# Altium project Tunguska.PrjPcb (part 3 of 4)

## Sheet Fan.SchDoc: Fan & Heater Control
size A4; Engineer: A. Küllenberg; Revision: A; SheetNumber: 9; SheetTotal: 10
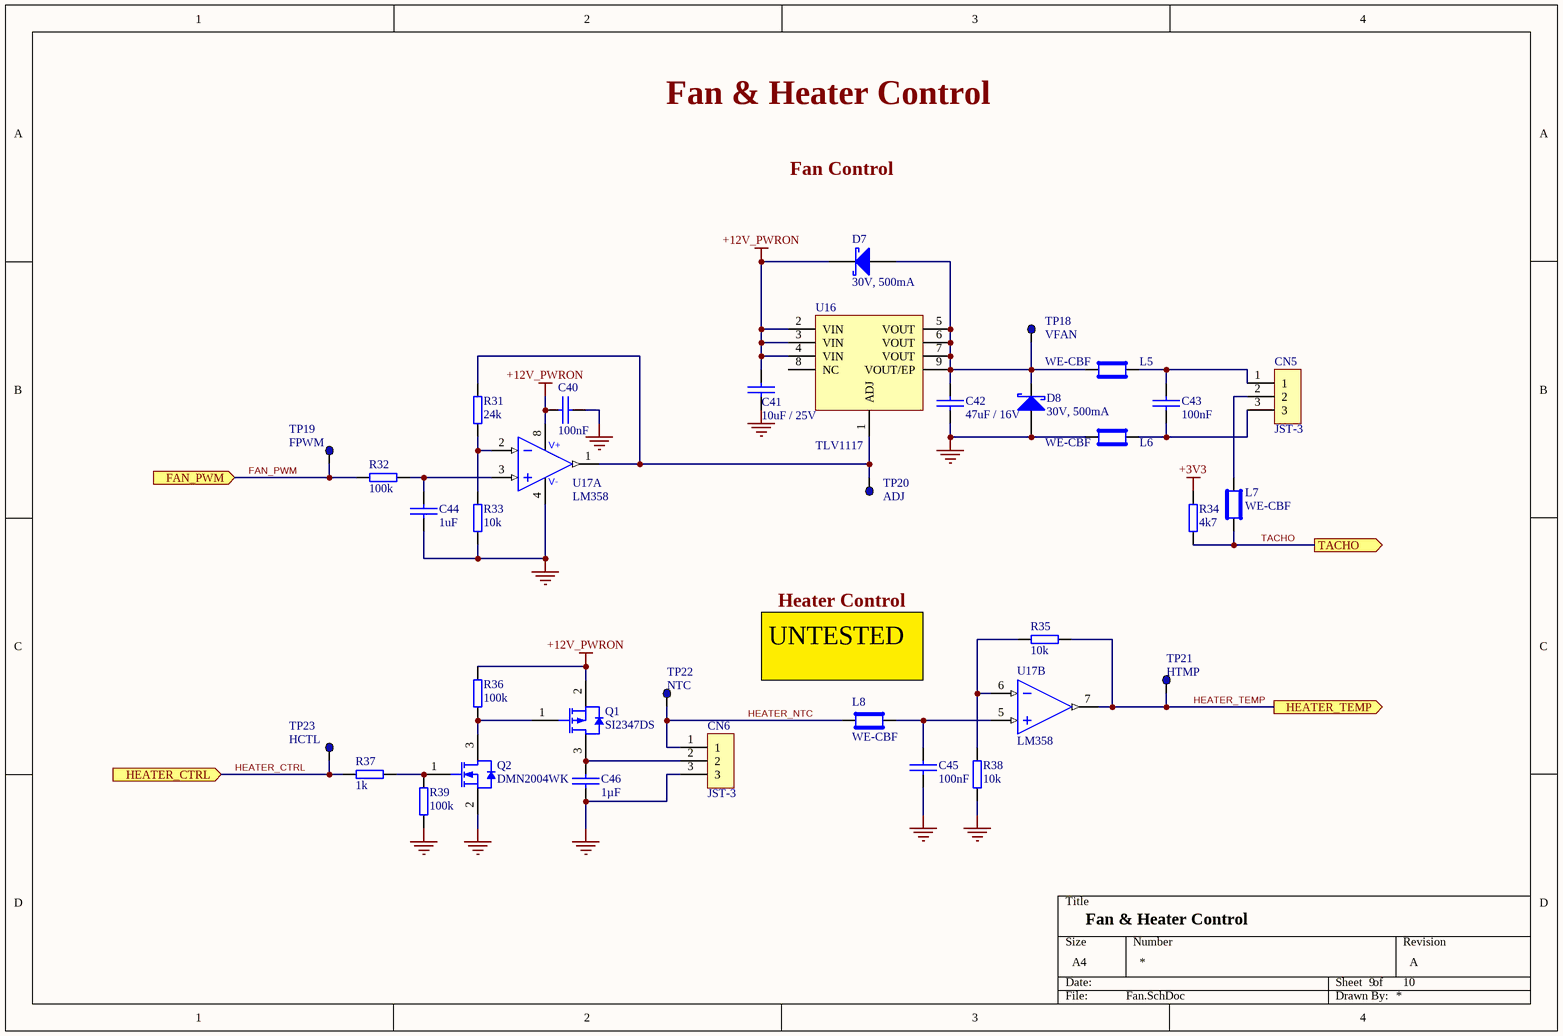
[diagram p4: Fan.SchDoc]

### Parts
C40  100nF  [C0603]
C41  10uF / 25V  [C0603]
C42  47uF / 16V  [C1206]
C43  100nF  [C0603]
C44  1uF  [C0603]
C45  100nF  [C0603]
C46  1µF  [C0805]
CN5  JST-3  [JST-3]
CN6  JST-3  [JST-3]
D7  30V, 500mA  [SOD523_N]
D8  30V, 500mA  [SOD523_N]
L5  WE-CBF  [L0603]
L6  WE-CBF  [L0603]
L7  WE-CBF  [L0603]
L8  WE-CBF  [L0603]
Q1  SI2347DS  [SOT23-3_N]
Q2  DMN2004WK  [SC-70]
R31  24k  [R0603]
R32  100k  [R0603]
R33  10k  [R0603]
R34  4k7  [R0603]
R35  10k  [R0603]
R36  100k  [R0603]
R37  1k  [R0603]
R38  10k  [R0603]
R39  100k  [R0603]
TP18  VFAN  [TP_1mm]  (no BOM)
TP19  FPWM  [TP_1mm]  (no BOM)
TP20  ADJ  [TP_1mm]  (no BOM)
TP21  HTMP  [TP_1mm]  (no BOM)
TP22  NTC  [TP_1mm]  (no BOM)
TP23  HCTL  [TP_1mm]  (no BOM)
U16  TLV1117  [QFN80P400X400X80_HS-9N]
U17  LM358  [DFN 2x2_LM358]  (parts A,B of 2)

### Ports
FAN_PWM (in), HEATER_CTRL (in), HEATER_TEMP (out), TACHO (out)

### Nets
+3V3: R34.2
+12V_PWRON: C40.1 C41.2 D7.2(K) Q1.2(S) R36.2 U16.2(VIN) U16.3(VIN) U16.4(VIN) U17.8(V+)
GND: C40.2 C41.1 C42.1 C44.1 C45.1 C46.1 CN6.3 D8.1(A) L6.1 Q2.2(S) R33.2 R38.1 R39.1 U17.4(V-)
FAN_PWM: R32.1 TP19.1 ; port FAN_PWM
HEATER_CTRL: R37.2 TP23.1 ; port HEATER_CTRL
HEATER_NTC: CN6.1 L8.1 TP22.1
HEATER_TEMP: R35.2 TP21.1 U17.7(OUT) ; port HEATER_TEMP  [project net ADC_IN3]
TACHO: L7.1 R34.1 ; port TACHO
NetC42_2: C42.2 D7.1(A) D8.2(K) L5.1 TP18.1 U16.5(VOUT) U16.6(VOUT) U16.7(VOUT) U16.9(VOUT/EP)
NetC43_1: C43.1 CN5.3 L6.2
NetC43_2: C43.2 CN5.1 L5.2
NetC44_2: C44.2 R32.2 U17.3(IN+)
NetC45_2: C45.2 L8.2 U17.5(IN+)
NetC46_2: C46.2 CN6.2 Q1.3(D)
NetCN5_2: CN5.2 L7.2
NetQ1_1: Q1.1(G) Q2.3(D) R36.1
NetQ2_1: Q2.1(G) R37.1 R39.2
NetR31_1: R31.1 R33.1 U17.2(IN-)
NetR31_2: R31.2 TP20.1 U16.1(ADJ) U17.1(OUT)
NetR35_1: R35.1 R38.2 U17.6(IN-)

Not connected (* = marked no-connect by the designer): U16 8(NC)

### Notes on the sheet
- Fan & Heater Control
- Fan Control
- Heater Control
- (near L8) UNTESTED

### Library data of the parts
C40 C43 C45 = C0603C104K5RACTU: CAP CER 0.1UF 50V X7R 0603; Manufacturer: Kemet; Capacitance: 0.10µF; Tolerance: ±10%; Part Number: C0603C104K5RACTU; Value: 100nF; Supplier 1: Digi-Key; Supplier Part Number 1: 399-5089-1-ND; Manufacturer Part Number: C0603C104K5RACTU; RoHS: RoHS Compliant; Category: Capacitors; Stock 1: 1628757; Pricing 1: 1=0.09, 10=0.037, 50=0.0198, 100=0.0167, 250=0.01372, 500=0.01174, 1000=0.00914 (EUR); Packaging: Cut Tape (CT); Voltage - Rated: 50V; Temperature Coefficient: X7R; Mounting Type: Surface Mount, MLCC; Operating Temperature: -55°C ~ 125°C; Applications: General Purpose; Ratings: -; Package / Case: 0603 (1608 Metric); Size / Dimension: 0.063" L x 0.031" W (1.60mm x 0.80mm); Height - Seated (Max): -; Thickness (Max): 0.034" (0.87mm); Lead Spacing: -; Features: -; Lead Style: -; ComponentLink1URL: http://www.kemet.com/docfinder?Partnumber=C0603C104K5RACTU; ComponentLink1Description: http://www.kemet.com/docfinder?Partnumber=C0603C104K5RACTU
C41 = ZRB18AR61E106ME01L: CAP CER 10UF 25V X5R 0603; Manufacturer: Murata Electronics North America; Capacitance: 10µF; Tolerance: ±20%; Part Number: ZRB18AR61E106ME01L; Value: 10uF / 25V; Supplier 1: Digi-Key; Supplier Part Number 1: 490-10991-1-ND; Manufacturer Part Number: ZRB18AR61E106ME01L; RoHS: RoHS Compliant; Category: Capacitors; Stock 1: 23575; Pricing 1: 1=0.4, 10=0.278, 25=0.2284, 50=0.195, 100=0.1671, 250=0.13924, 500=0.12532, 1000=0.10583 (EUR); Packaging: Cut Tape (CT); Voltage - Rated: 25V; Temperature Coefficient: X5R; Mounting Type: Surface Mount, MLCC; Operating Temperature: -55°C ~ 85°C; Applications: Acoustic Noise Reduction; Ratings: -; Package / Case: 0603 (1608 Metric); Size / Dimension: 0.063" L x 0.031" W (1.60mm x 0.80mm); Height - Seated (Max): -; Thickness (Max): 0.047" (1.20mm); Lead Spacing: -; Features: Interposer Termination; Lead Style: -; ComponentLink1URL: http://search.murata.co.jp/Ceramy/image/img/A01X/G101/ENG/ZRB18AR61E106ME01-01.pdf; ComponentLink1Description: http://search.murata.co.jp/Ceramy/image/img/A01X/G101/ENG/ZRB18AR61E106ME01-01.pdf; Part Status: Active
C42 = C3216X5R1C476M160AB: CAP CER 47UF 16V X5R 1206; Manufacturer: TDK Corporation; Capacitance: 47µF; Tolerance: ±20%; Part Number: C3216X5R1C476M160AB; Value: 47uF / 16V; Supplier 1: Digi-Key; Supplier Part Number 1: 445-6003-1-ND; Manufacturer Part Number: C3216X5R1C476M160AB; RoHS: RoHS Compliant; Category: Capacitors; Stock 1: 181623; Pricing 1: 1=0.92, 10=0.724, 25=0.6636, 50=0.6272, 100=0.5427, 250=0.48244, 500=0.41008, 1000=0.36184 (EUR); Packaging: Cut Tape (CT); Voltage - Rated: 16V; Temperature Coefficient: X5R; Mounting Type: Surface Mount, MLCC; Operating Temperature: -55°C ~ 85°C; Applications: General Purpose; Ratings: -; Package / Case: 1206 (3216 Metric); Size / Dimension: 0.126" L x 0.063" W (3.20mm x 1.60mm); Height - Seated (Max): -; Thickness (Max): 0.071" (1.80mm); Lead Spacing: -; Features: Low ESL; Lead Style: -; ComponentLink1URL: https://product.tdk.com/info/en/catalog/datasheets/mlcc_commercial_general_en.pdf; ComponentLink1Description: https://product.tdk.com/info/en/catalog/datasheets/mlcc_commercial_general_en.pdf; Part Status: Active; Failure Rate: -
C44 = GCM188R71E105KA64D: CAP CER 1UF 25V X7R 0603; Manufacturer: Murata Electronics North America; Capacitance: 1µF; Tolerance: ±10%; Part Number: GCM188R71E105KA64D; Value: 1uF; Supplier 1: Digi-Key; Supplier Part Number 1: 490-10673-1-ND; Manufacturer Part Number: GCM188R71E105KA64D; RoHS: RoHS Compliant; Category: Capacitors; Stock 1: 53908; Pricing 1: 1=0.19, 10=0.13, 50=0.0748, 100=0.0617, 250=0.05196, 500=0.04352, 1000=0.03572 (EUR); Packaging: Cut Tape (CT); Voltage - Rated: 25V; Temperature Coefficient: X7R; Mounting Type: Surface Mount, MLCC; Operating Temperature: -55°C ~ 125°C; Applications: Automotive; Ratings: AEC-Q200; Package / Case: 0603 (1608 Metric); Size / Dimension: 0.063" L x 0.031" W (1.60mm x 0.80mm); Height - Seated (Max): -; Thickness (Max): 0.035" (0.90mm); Lead Spacing: -; Features: -; Lead Style: -; ComponentLink1URL: http://www.murata.com/~/media/webrenewal/support/library/catalog/products/capacitor/mlcc/c03e.ashx; ComponentLink1Description: http://www.murata.com/~/media/webrenewal/support/library/catalog/products/capacitor/mlcc/c03e.ashx
C46 = C0805C105K5RACTU: CAP CER 1UF 50V X7R 0805; Manufacturer: Kemet; Tolerance: ±10%; Part Number: C0805C105K5RACTU; Value: 1µF; Supplier 1: Digi-Key; Supplier Part Number 1: 399-7409-1-ND; Manufacturer Part Number: C0805C105K5RACTU; RoHS: RoHS Compliant; Category: Capacitors; Stock 1: 161342; Pricing 1: 1=0.31, 10=0.254, 50=0.1428, 100=0.1268, 250=0.09508, 500=0.084, 1000=0.07449 (EUR); Packaging: Cut Tape (CT); Capacitance: 1µF; Voltage - Rated: 50V; Temperature Coefficient: X7R; Mounting Type: Surface Mount, MLCC; Operating Temperature: -55°C ~ 125°C; Applications: General Purpose; Ratings: -; Package / Case: 0805 (2012 Metric); Size / Dimension: 0.079" L x 0.049" W (2.00mm x 1.25mm); Height - Seated (Max): -; Thickness (Max): 0.055" (1.40mm); Lead Spacing: -; Features: -; Lead Style: -; ComponentLink1URL: http://www.kemet.com/docfinder?Partnumber=C0805C105K5RACTU; ComponentLink1Description: http://www.kemet.com/docfinder?Partnumber=C0805C105K5RACTU
CN5 CN6 = B3B-XH-A(LF)(SN): CONN HEADER XH TOP 3POS 2.5MM; Manufacturer: JST Sales America Inc.; Number of Positions: 3; Number of Positions Loaded: All; Current Rating: 3A; Voltage Rating: 250V; Pitch - Mating: 0.098" (2.50mm); Shrouding: Shrouded - 4 Wall; Style: Board to Cable/Wire; Contact Length - Post: 0.134" (3.40mm); Material Flammability Rating: UL94 V-0; Mated Stacking Heights: 9.8mm; Part Number: B3B-XH-A(LF)(SN); Value: JST-3; Supplier 1: Digi-Key; Supplier Part Number 1: 455-2248-ND; Manufacturer Part Number: B3B-XH-A(LF)(SN); RoHS: RoHS Compliant; Category: Connectors, Interconnects; Stock 1: 206315; Pricing 1: 1=0.18, 10=0.171, 100=0.1053, 500=0.08712, 1000=0.07623, 5000=0.06534, 10000=0.06352 (EUR); Packaging: Bulk; Connector Type: Header; Contact Type: Male Pin; Number of Rows: 1; Mounting Type: Through Hole; Termination: Press-Fit, Solder; Fastening Type: Detent Lock; Features: -; ComponentLink1URL: http://www.jst-mfg.com/product/pdf/eng/eXH.pdf; ComponentLink1Description: http://www.jst-mfg.com/product/pdf/eng/eXH.pdf; Contact Material: Brass; Operating Temperature: -25°C ~ 85°C; Part Status: Active; Row Spacing - Mating: -; Contact Length - Mating: -; Contact Finish - Mating: Tin; Contact Finish Thickness - Mating: -; Insulation Color: Natural; Overall Contact Length: -; Insulation Height: 0.276" (7.00mm); Contact Shape: Square; Ingress Protection: -; Contact Finish - Post: Tin; Insulation Material: Polyamide (PA66), Nylon 6/6; Contact Finish Thickness - Post: -; Applications: -
D7 D8 = BAS 3005B-02V H6327: DIODE SCHOTTKY 30V 500MA SC79-2; Manufacturer: Infineon Technologies; Current - Reverse Leakage @ Vr: 25µA @ 30V; Voltage - Forward (Vf) (Max) @ If: 620mV @ 500mA; Current - Average Rectified (Io): 500mA (DC); Speed: Fast Recovery =< 500ns, > 200mA (Io); Capacitance @ Vr, F: 10pF @ 5V, 1MHz; Part Number: BAS 3005B-02V H6327; Value: 30V, 500mA; Supplier 1: Digi-Key; Supplier Part Number 1: BAS 3005B-02V H6327CT-ND; Manufacturer Part Number: BAS 3005B-02V H6327; RoHS: RoHS Compliant; Category: Discrete Semiconductor Products; Stock 1: 33141; Pricing 1: 1=0.34, 10=0.26, 100=0.1619, 500=0.11066, 1000=0.08507 (EUR); Packaging: Cut Tape (CT); Mounting Type: Surface Mount; Package / Case: SC-79, SOD-523; Supplier Device Package: PG-SC79-2; ComponentLink1URL: http://www.infineon.com/dgdl/Infineon-BAS3005B-DS-v01_01-en.pdf?fileId=db3a30432d9b3066012db880a14b0bc1; ComponentLink1Description: http://www.infineon.com/dgdl/Infineon-BAS3005B-DS-v01_01-en.pdf?fileId=db3a30432d9b3066012db880a14b0bc1; Diode Type: Schottky; Voltage - DC Reverse (Vr) (Max): 30V; Reverse Recovery Time (trr): -; Operating Temperature - Junction: -55°C ~ 125°C
L5-L8 = 742792651: FERRITE BEAD 600 OHM 0603 1LN; Manufacturer: Wurth Electronics Inc.; Filter Type: Signal Line; Number of Lines: 1; Impedance @ Frequency: 600 Ohm @ 100MHz; Current Rating (Max): 1A; DC Resistance (DCR) (Max): 200 mOhm; Part Number: 742792651; Value: WE-CBF; Supplier 1: Digi-Key; Supplier Part Number 1: 732-1593-1-ND; Manufacturer Part Number: 742792651; RoHS: RoHS Compliant; Category: Filters; Stock 1: 99870; Pricing 1: 1=0.22, 10=0.185, 50=0.1806, 100=0.1667, 1000=0.15164 (EUR); Packaging: Cut Tape (CT); Part Status: Active; Ratings: -; Operating Temperature: -55°C ~ 125°C; Package / Case: 0603 (1608 Metric); Mounting Type: Surface Mount; Height (Max): 0.039" (1.00mm); Size / Dimension: 0.063" L x 0.031" W (1.60mm x 0.80mm); ComponentLink1URL: http://katalog.we-online.de/pbs/datasheet/742792651.pdf; ComponentLink1Description: http://katalog.we-online.de/pbs/datasheet/742792651.pdf
Q1 = SI2347DS-T1-GE3: MOSFET P-CH 30V 5A SOT-23; Manufacturer: Vishay Siliconix; FET Type: P-Channel; Current - Continuous Drain (Id) @ 25°C: 5A (Tc); Rds On (Max) @ Id, Vgs: 42 mOhm @ 3.8A, 10V; Vgs(th) (Max) @ Id: 2.5V @ 250µA; Drive Voltage (Max Rds On,  Min Rds On): 4.5V, 10V; Gate Charge (Qg) (Max) @ Vgs: 22nC @ 10V; Input Capacitance (Ciss) (Max) @ Vds: 705pF @ 15V; Vgs (Max): ±20V; Power Dissipation (Max): 1.7W (Tc); Part Number: SI2347DS-T1-GE3; Value: SI2347DS; Supplier 1: Digi-Key; Supplier Part Number 1: SI2347DS-T1-GE3CT-ND; Manufacturer Part Number: SI2347DS-T1-GE3; RoHS: RoHS Compliant; Category: Discrete Semiconductor Products; Stock 1: 19854; Pricing 1: 1=0.41, 10=0.309, 25=0.2784, 100=0.1922, 250=0.16184, 500=0.13148, 1000=0.10114 (EUR); Packaging: Cut Tape (CT); FET Feature: -; Drain to Source Voltage (Vdss): 30V; Mounting Type: Surface Mount; Package / Case: TO-236-3, SC-59, SOT-23-3; Supplier Device Package: SOT-23-3; ComponentLink1URL: http://www.vishay.com/docs/62827/si2347ds.pdf; ComponentLink1Description: http://www.vishay.com/docs/62827/si2347ds.pdf; Operating Temperature: -55°C ~ 150°C (TJ); Part Status: Active; Technology: MOSFET (Metal Oxide)
Q2 = DMN2004WK-7: MOSFET N-CH 20V 540MA SC70-3; Manufacturer: Diodes Incorporated; FET Type: N-Channel; Current - Continuous Drain (Id) @ 25°C: 540mA (Ta); Rds On (Max) @ Id, Vgs: 550 mOhm @ 540mA, 4.5V; Vgs(th) (Max) @ Id: 1V @ 250µA; Drive Voltage (Max Rds On,  Min Rds On): 1.8V, 4.5V; Input Capacitance (Ciss) (Max) @ Vds: 150pF @ 16V; Vgs (Max): ±8V; Power Dissipation (Max): 200mW (Ta); Part Number: DMN2004WK-7; Value: DMN2004WK; Supplier 1: Digi-Key; Supplier Part Number 1: DMN2004WKDICT-ND; Manufacturer Part Number: DMN2004WK-7; RoHS: RoHS Compliant; Category: Discrete Semiconductor Products; Stock 1: 14846; Pricing 1: 1=0.43, 10=0.324, 100=0.2013, 500=0.13776, 1000=0.10596 (EUR); Packaging: Cut Tape (CT); FET Feature: -; Drain to Source Voltage (Vdss): 20V; Mounting Type: Surface Mount; Package / Case: SC-70, SOT-323; Supplier Device Package: SOT-323; ComponentLink1URL: https://www.diodes.com/assets/Datasheets/ds30934.pdf; ComponentLink1Description: https://www.diodes.com/assets/Datasheets/ds30934.pdf; Operating Temperature: -55°C ~ 150°C (TJ); Part Status: Active; Technology: MOSFET (Metal Oxide); Gate Charge (Qg) (Max) @ Vgs: -
R31 = RC0603FR-0724KL: RES SMD 24K OHM 1% 1/10W 0603; Manufacturer: Yageo; Power (Watts): 0.1W, 1/10W; Temperature Coefficient: ±100ppm/°C; Part Number: RC0603FR-0724KL; Value: 24k; Manufacturer Part Number: RC0603FR-0724KL; RoHS: RoHS Compliant; Category: Resistors; Stock 1: 315278; Pricing 1: 1=0.09, 10=0.012, 25=0.0088, 50=0.0066, 100=0.0049, 250=0.00372, 500=0.00298, 1000=0.0022 (EUR); Packaging: Cut Tape (CT); Resistance (Ohms): 24k; Tolerance: ±1%; Composition: Thick Film; Features: Moisture Resistant; Operating Temperature: -55°C ~ 155°C; Package / Case: 0603 (1608 Metric); Supplier Device Package: 0603; Size / Dimension: 0.063" L x 0.031" W (1.60mm x 0.80mm); ComponentLink1URL: http://www.yageo.com/documents/recent/PYu-RC_Group_51_RoHS_L_6.pdf; ComponentLink1Description: http://www.yageo.com/documents/recent/PYu-RC_Group_51_RoHS_L_6.pdf; Supplier 1: Digi-Key; Supplier Part Number 1: 311-24.0KHRCT-ND; Height - Seated (Max): 0.022" (0.55mm); Part Status: Active; Failure Rate: -
R32 R36 R39 = RC0603FR-07100KL: RES SMD 100K OHM 1% 1/10W 0603; Manufacturer: Yageo; Power (Watts): 0.1W, 1/10W; Temperature Coefficient: ±100ppm/°C; Part Number: RC0603FR-07100KL; Value: 100k; Manufacturer Part Number: RC0603FR-07100KL; RoHS: RoHS Compliant; Category: Resistors; Stock 1: 6595647; Pricing 1: 1=0.09, 10=0.012, 25=0.0088, 50=0.007, 100=0.0051, 250=0.00388, 500=0.0031, 1000=0.00229 (EUR); Packaging: Cut Tape (CT); Resistance (Ohms): 100k; Tolerance: ±1%; Composition: Thick Film; Features: Moisture Resistant; Operating Temperature: -55°C ~ 155°C; Package / Case: 0603 (1608 Metric); Supplier Device Package: 0603; Size / Dimension: 0.063" L x 0.031" W (1.60mm x 0.80mm); ComponentLink1URL: http://www.yageo.com/documents/recent/PYu-RC_Group_51_RoHS_L_7.pdf; ComponentLink1Description: http://www.yageo.com/documents/recent/PYu-RC_Group_51_RoHS_L_7.pdf; Supplier 1: Digi-Key; Supplier Part Number 1: 311-100KHRCT-ND; Height - Seated (Max): 0.022" (0.55mm); Part Status: Active; Failure Rate: -
R33 R35 R38 = RC0603FR-0710KL: RES SMD 10K OHM 1% 1/10W 0603; Manufacturer: Yageo; Power (Watts): 0.1W, 1/10W; Temperature Coefficient: ±100ppm/°C; Part Number: RC0603FR-0710KL; Value: 10k; Manufacturer Part Number: RC0603FR-0710KL; RoHS: RoHS Compliant; Category: Resistors; Stock 1: 14298796; Pricing 1: 1=0.09, 10=0.012, 25=0.0088, 50=0.007, 100=0.0051, 250=0.00388, 500=0.0031, 1000=0.00229 (EUR); Packaging: Cut Tape (CT); Resistance (Ohms): 10k; Tolerance: ±1%; Composition: Thick Film; Features: Moisture Resistant; Operating Temperature: -55°C ~ 155°C; Package / Case: 0603 (1608 Metric); Supplier Device Package: 0603; Size / Dimension: 0.063" L x 0.031" W (1.60mm x 0.80mm); ComponentLink1URL: http://www.yageo.com/documents/recent/PYu-RC_Group_51_RoHS_L_7.pdf; ComponentLink1Description: http://www.yageo.com/documents/recent/PYu-RC_Group_51_RoHS_L_7.pdf; Supplier 1: Digi-Key; Supplier Part Number 1: 311-10.0KHRCT-ND; Height - Seated (Max): 0.022" (0.55mm); Part Status: Active; Failure Rate: -
R34 = CRCW06034K70FKEA: RES SMD 4.7K OHM 1% 1/10W 0603; Manufacturer: Vishay Dale; Power (Watts): 0.1W, 1/10W; Temperature Coefficient: ±100ppm/°C; Part Number: CRCW06034K70FKEA; Value: 4k7; Manufacturer Part Number: CRCW06034K70FKEA; RoHS: RoHS Compliant; Category: Resistors; Stock 1: 324271; Pricing 1: 1=0.09, 10=0.027, 25=0.0196, 50=0.015, 100=0.011, 250=0.0084, 500=0.00674, 1000=0.00496, 2500=0.00431 (EUR); Packaging: Cut Tape (CT); Resistance (Ohms): 4.7k; Tolerance: ±1%; Composition: Thick Film; Features: Automotive AEC-Q200; Operating Temperature: -55°C ~ 155°C; Package / Case: 0603 (1608 Metric); Supplier Device Package: 0603; Size / Dimension: 0.061" L x 0.033" W (1.55mm x 0.85mm); Height: 0.020" (0.50mm); Number of Terminations: 2; ComponentLink1URL: http://www.vishay.com/docs/20035/dcrcwe3.pdf; ComponentLink1Description: http://www.vishay.com/docs/20035/dcrcwe3.pdf; Supplier 1: Digi-Key; Supplier Part Number 1: 541-4.70KHCT-ND
R37 = CRCW06031K00FKEA: RES SMD 1K OHM 1% 1/10W 0603; Manufacturer: Vishay Dale; Power (Watts): 0.1W, 1/10W; Temperature Coefficient: ±100ppm/°C; Part Number: CRCW06031K00FKEA; Value: 1k; Manufacturer Part Number: CRCW06031K00FKEA; RoHS: RoHS Compliant; Category: Resistors; Stock 1: 862886; Pricing 1: 1=0.09, 10=0.027, 25=0.0196, 50=0.015, 100=0.011, 250=0.0084, 500=0.00674, 1000=0.00496, 2500=0.00431 (EUR); Packaging: Cut Tape (CT); Resistance (Ohms): 1k; Tolerance: ±1%; Composition: Thick Film; Features: Automotive AEC-Q200; Operating Temperature: -55°C ~ 155°C; Package / Case: 0603 (1608 Metric); Supplier Device Package: 0603; Size / Dimension: 0.061" L x 0.033" W (1.55mm x 0.85mm); Height: 0.020" (0.50mm); Number of Terminations: 2; ComponentLink1URL: http://www.vishay.com/docs/20035/dcrcwe3.pdf; ComponentLink1Description: http://www.vishay.com/docs/20035/dcrcwe3.pdf; Supplier 1: Digi-Key; Supplier Part Number 1: 541-1.00KHCT-ND
TP18-TP23 = TP: Value: TP; Part Number: TP
U16 = TLV1117IDRJR: IC REG LDO ADJ 0.8A 8SON; Manufacturer: Texas Instruments; Regulator Topology: Positive Adjustable; Voltage - Output: Adjustable; Current - Output: 800mA; Voltage - Dropout (Typical): 1.2V @ 800mA; Voltage - Input: 2.7 V ~ 15 V; Part Number: TLV1117IDRJR; Value: TLV1117; Supplier 1: Digi-Key; Supplier Part Number 1: 296-19517-1-ND; Manufacturer Part Number: TLV1117IDRJR; RoHS: RoHS Compliant; Category: Integrated Circuits (ICs); Stock 1: 3485; Pricing 1: 1=0.62, 10=0.549, 100=0.4209, 500=0.3328 (EUR); Packaging: Cut Tape (CT); Current - Limit (Min): 800mA; Operating Temperature: -40°C ~ 125°C; Mounting Type: Surface Mount; Package / Case: 8-WDFN Exposed Pad; Supplier Device Package: 8-SON (4x4); ComponentLink1URL: http://www.ti.com/lit/ds/symlink/tlv1117.pdf; ComponentLink1Description: http://www.ti.com/lit/ds/symlink/tlv1117.pdf; Part Status: Active
U17 = LM358QT: IC OPAMP GP 1.1MHZ 8DFN; Manufacturer: STMicroelectronics; Amplifier Type: General Purpose; Number of Circuits: 2; Slew Rate: 0.6 V/µs; Current - Supply: 700µA; Current - Output / Channel: 60mA; Voltage - Supply, Single/Dual (±): 3 V ~ 30 V, ±1.5 V ~ 15 V; Part Number: LM358QT; Value: LM358; Supplier 1: Digi-Key; Supplier Part Number 1: 497-12007-1-ND; Manufacturer Part Number: LM358QT; RoHS: RoHS Compliant; Category: Integrated Circuits (ICs); Stock 1: 1511; Pricing 1: 1=0.43, 10=0.324, 100=0.2013, 500=0.13776, 1000=0.10596 (EUR); Packaging: Cut Tape (CT); Output Type: -; -3db Bandwidth: -; Operating Temperature: 0°C ~ 70°C; Mounting Type: Surface Mount; Package / Case: 8-UFDFN Exposed Pad; Supplier Device Package: 8-DFN (2x2); ComponentLink1URL: http://www.st.com/content/ccc/resource/technical/document/datasheet/61/46/87/01/98/ed/44/c5/CD00000464.pdf/files/CD00000464.pdf/jcr:content/translations/en.CD00000464.pdf; ComponentLink1Description: http://www.st.com/content/ccc/resource/technical/document/datasheet/61/46/87/01/98/ed/44/c5/CD00000464.pdf/files/CD00000464.pdf/jcr:content/translations/en.CD00000464.pdf; Part Status: Active

## Sheet PowerPath.SchDoc: Power Path
size A4; DrawnBy: A. Küllenberg; Revision: A; SheetNumber: 4; SheetTotal: 10
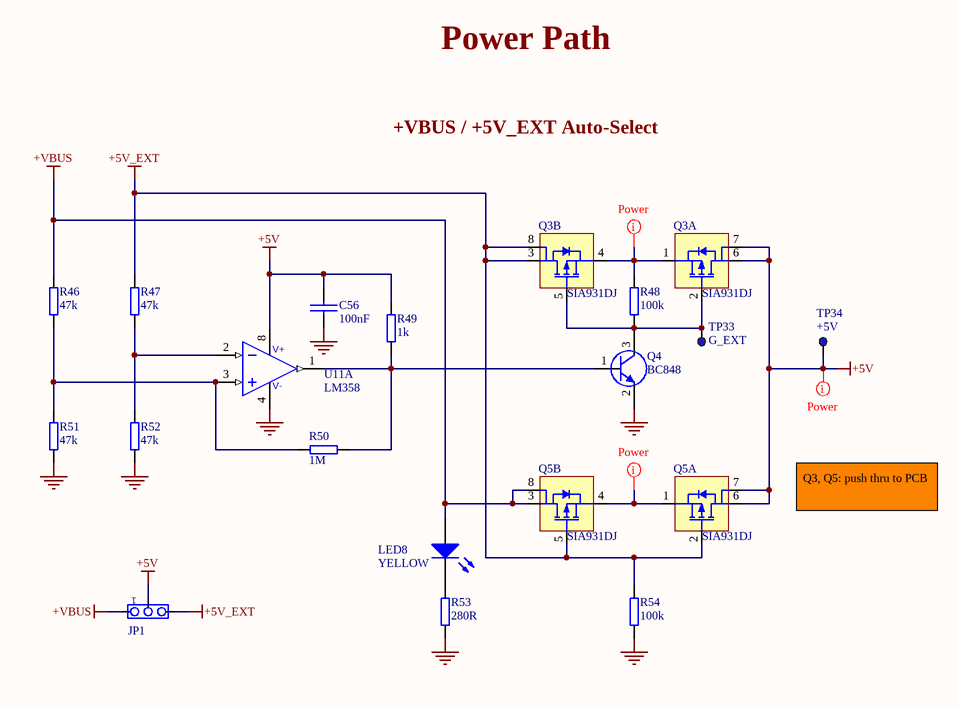
[diagram p5: PowerPath.SchDoc]

### Parts
C56  100nF  [C0603]
JP1  JP  [HDR1x3]  (value not drawn)
LED8  YELLOW  [LED_0603_YELLOW]
Q3  SIA931DJ  [PowerPAK SC-70-6L Dual]  (parts A,B of 2)
Q4  BC848  [SC-70]
Q5  SIA931DJ  [PowerPAK SC-70-6L Dual]  (parts A,B of 2)
R46  47k  [R0603]
R47  47k  [R0603]
R48  100k  [R0603]
R49  1k  [R0603]
R50  1M  [R0603]
R51  47k  [R0603]
R52  47k  [R0603]
R53  280R  [R0603]
R54  100k  [R0603]
TP33  G_EXT  [TP_1mm]  (no BOM)
TP34  +5V  [TP_1mm]  (no BOM)
U11  LM358  [DFN 2x2_LM358]  (part A of 2)

### Nets
+5V: C56.2 JP1.2 Q3.6(D1) Q3.7(D1) Q5.6(D1) Q5.7(D1) R49.2 TP34.1 U11.8(V+)
+5V_EXT: JP1.3 Q3.3(D2) Q3.8(D2) Q5.2(G1) Q5.5(G2) R47.2 R54.2
+VBUS: JP1.1 LED8.1(A) Q5.3(D2) Q5.8(D2) R46.2
GND: C56.1 Q4.2 R51.1 R52.1 R53.1 R54.1 U11.4(V-)
NetLED8_2: LED8.2(K) R53.2
NetQ3_1: Q3.1(S1) Q3.4(S2) R48.2
NetQ3_2: Q3.2(G1) Q3.5(G2) Q4.3 R48.1 TP33.1
NetQ4_1: Q4.1 R49.1 R50.1 U11.1(OUT)
NetQ5_1: Q5.1(S1) Q5.4(S2)
NetR46_1: R46.1 R50.2 R51.2 U11.3(IN+)
NetR47_1: R47.1 R52.2 U11.2(IN-)

### Layout directives
net class Power: +5V, NetQ3_1, NetQ5_1

### Notes on the sheet
- Power Path
- +VBUS / +5V_EXT Auto-Select
- Q3, Q5: push thru to PCB

### Library data of the parts
C56 = C0603C104K5RACTU: as C40 on sheet Fan; Part Number: C0603C104K5RACTU; Value: 100nF; Supplier 1: Digi-Key; Supplier Part Number 1: 399-5089-1-ND; Manufacturer Part Number: C0603C104K5RACTU; RoHS: RoHS Compliant; Category: Capacitors; Stock 1: 1628757; Pricing 1: 1=0.09, 10=0.037, 50=0.0198, 100=0.0167, 250=0.01372, 500=0.01174, 1000=0.00914 (EUR); Packaging: Cut Tape (CT); Voltage - Rated: 50V; Temperature Coefficient: X7R; Mounting Type: Surface Mount, MLCC; Operating Temperature: -55°C ~ 125°C; Applications: General Purpose; Ratings: -; Package / Case: 0603 (1608 Metric); Size / Dimension: 0.063" L x 0.031" W (1.60mm x 0.80mm); Height - Seated (Max): -; Thickness (Max): 0.034" (0.87mm); Lead Spacing: -; Features: -; Lead Style: -; ComponentLink1URL: http://www.kemet.com/docfinder?Partnumber=C0603C104K5RACTU; ComponentLink1Description: http://www.kemet.com/docfinder?Partnumber=C0603C104K5RACTU
JP1 = 61300311121: CONN HEADER 3 POS 2.54; Manufacturer: Wurth Electronics Inc.; Pitch - Mating: 0.100" (2.54mm); Style: Board to Board or Cable; Shrouding: Unshrouded; Number of Positions: 3; Number of Positions Loaded: All; Contact Length - Mating: 0.236" (6.00mm); Contact Length - Post: 0.118" (3.00mm); Overall Contact Length: 0.454" (11.54mm); Material Flammability Rating: UL94 V-0; Current Rating: 3A; Voltage Rating: 250V; Part Number: 61300311121; Value: JP; Supplier 1: Digi-Key; Supplier Part Number 1: 732-5316-ND; Manufacturer Part Number: 61300311121; RoHS: RoHS Compliant; Category: Connectors, Interconnects; Stock 1: 31558; Pricing 1: 1=0.21, 10=0.191, 25=0.1628, 50=0.1424, 100=0.1323, 1000=0.09157 (EUR); Packaging: Bulk; Part Status: Active; Connector Type: Header; Contact Type: Male Pin; Number of Rows: 1; Row Spacing - Mating: -; Mounting Type: Through Hole; Termination: Solder; Fastening Type: -; Insulation Height: 0.100" (2.54mm); Contact Shape: Square; Contact Finish - Mating: Gold; Contact Finish Thickness - Mating: -; Contact Finish - Post: -; Contact Material: Copper Alloy; Insulation Material: Polybutylene Terephthalate (PBT); Features: -; Operating Temperature: -40°C ~ 125°C; Ingress Protection: -; Insulation Color: Black; Mated Stacking Heights: -; Contact Finish Thickness - Post: -; Applications: -; ComponentLink1URL: http://katalog.we-online.de/em/datasheet/6130xx11121.pdf; ComponentLink1Description: http://katalog.we-online.de/em/datasheet/6130xx11121.pdf
LED8 = LTST-C190KSKT: LED YELLOW CLEAR 0603 SMD; Manufacturer: Lite-On Inc.; Voltage - Forward (Vf) (Typ): 2.1V; Viewing Angle: 130°; Wavelength - Dominant: 591nm; Wavelength - Peak: 588nm; Millicandela Rating: 104mcd; Current - Test: 20mA; Lens Color: Colorless; Lens Style/Size: Rectangle with Flat Top, 1.10mm x 0.80mm; Part Number: LTST-C190KSKT; Value: YELLOW; Supplier 1: Digi-Key; Supplier Part Number 1: 160-1437-1-ND; Manufacturer Part Number: LTST-C190KSKT; RoHS: RoHS Compliant; Category: Optoelectronics; Stock 1: 229638; Pricing 1: 1=0.27, 10=0.199, 25=0.1468, 100=0.1049, 250=0.07132, 500=0.06292, 1000=0.0493 (EUR); Packaging: Cut Tape (CT); Mounting Type: Surface Mount; Package / Case: 0603 (1608 Metric); ComponentLink1URL: http://optoelectronics.liteon.com/upload/download/DS-22-99-0189/S_110_LTST-C190KSKT.pdf; ComponentLink1Description: http://optoelectronics.liteon.com/upload/download/DS-22-99-0189/S_110_LTST-C190KSKT.pdf; Color: Yellow; Lens Transparency: Clear; Size / Dimension: 1.60mm L x 0.80mm W; Height (Max): 0.80mm; Features: -; Part Status: Active
Q3 Q5 = SIA931DJ-T1-GE3: MOSFET 2P-CH 30V 4.5A SC70-6L; Manufacturer: Vishay Siliconix; FET Type: 2 P-Channel (Dual); FET Feature: Logic Level Gate; Rds On (Max) @ Id, Vgs: 65 mOhm @ 3A, 10V; Vgs(th) (Max) @ Id: 2.2V @ 250µA; Power - Max: 7.8W; Gate Charge (Qg) (Max) @ Vgs: 13nC @ 10V; Input Capacitance (Ciss) (Max) @ Vds: 445pF @ 15V; Part Number: SIA931DJ-T1-GE3; Value: SIA931DJ; Supplier 1: Digi-Key; Supplier Part Number 1: SIA931DJ-T1-GE3CT-ND; Manufacturer Part Number: SIA931DJ-T1-GE3; RoHS: RoHS Compliant; Category: Discrete Semiconductor Products; Stock 1: 5457; Pricing 1: 1=0.51, 10=0.44, 25=0.4108, 100=0.3287, 250=0.30524, 500=0.2583, 1000=0.19959 (EUR); Packaging: Cut Tape (CT); Drain to Source Voltage (Vdss): 30V; Current - Continuous Drain (Id) @ 25°C: 4.5A; Mounting Type: Surface Mount; Package / Case: PowerPAK® SC-70-6 Dual; Supplier Device Package: PowerPAK® SC-70-6 Dual; ComponentLink1URL: http://www.vishay.com/docs/62859/sia931dj.pdf; ComponentLink1Description: http://www.vishay.com/docs/62859/sia931dj.pdf; Operating Temperature: -55°C ~ 150°C (TJ); Part Status: Active
Q4 = BC848W,115: TRANS NPN 30V 0.1A SOT323; Manufacturer: Nexperia USA Inc.; Current - Collector (Ic) (Max): 100mA; Vce Saturation (Max) @ Ib, Ic: 600mV @ 5mA, 100mA; Current - Collector Cutoff (Max): 15nA (ICBO); DC Current Gain (hFE) (Min) @ Ic, Vce: 110 @ 2mA, 5V; Power - Max: 200mW; Frequency - Transition: 100MHz; Part Number: BC848W,115; Value: BC848; Supplier 1: Digi-Key; Supplier Part Number 1: 1727-6193-1-ND; Manufacturer Part Number: BC848W,115; RoHS: RoHS Compliant; Category: Discrete Semiconductor Products; Stock 1: 2939; Pricing 1: 1=0.13, 10=0.12, 100=0.0651, 500=0.04004, 1000=0.02731 (EUR); Packaging: Cut Tape (CT); Part Status: Active; Transistor Type: NPN; Voltage - Collector Emitter Breakdown (Max): 30V; Operating Temperature: 150°C (TJ); Mounting Type: Surface Mount; Package / Case: SC-70, SOT-323; Supplier Device Package: SOT-323-3; ComponentLink1URL: http://assets.nexperia.com/documents/data-sheet/BC848_SER.pdf; ComponentLink1Description: http://assets.nexperia.com/documents/data-sheet/BC848_SER.pdf
R46 R47 R51 R52 = RC0603FR-0747KL: RES SMD 47K OHM 1% 1/10W 0603; Manufacturer: Yageo; Power (Watts): 0.1W, 1/10W; Temperature Coefficient: ±100ppm/°C; Part Number: RC0603FR-0747KL; Value: 47k; Manufacturer Part Number: RC0603FR-0747KL; RoHS: RoHS Compliant; Category: Resistors; Stock 1: 2291730; Pricing 1: 1=0.09, 10=0.012, 25=0.0088, 50=0.007, 100=0.0051, 250=0.00388, 500=0.0031, 1000=0.00229 (EUR); Packaging: Cut Tape (CT); Resistance (Ohms): 47k; Tolerance: ±1%; Composition: Thick Film; Features: Moisture Resistant; Operating Temperature: -55°C ~ 155°C; Package / Case: 0603 (1608 Metric); Supplier Device Package: 0603; Size / Dimension: 0.063" L x 0.031" W (1.60mm x 0.80mm); ComponentLink1URL: http://www.yageo.com/documents/recent/PYu-RC_Group_51_RoHS_L_7.pdf; ComponentLink1Description: http://www.yageo.com/documents/recent/PYu-RC_Group_51_RoHS_L_7.pdf; Supplier 1: Digi-Key; Supplier Part Number 1: 311-47.0KHRCT-ND; Height - Seated (Max): 0.022" (0.55mm); Part Status: Active; Failure Rate: -
R48 R54 = RC0603FR-07100KL: as R32 on sheet Fan; Part Number: RC0603FR-07100KL; Value: 100k; Manufacturer Part Number: RC0603FR-07100KL; RoHS: RoHS Compliant; Category: Resistors; Stock 1: 6595647; Pricing 1: 1=0.09, 10=0.012, 25=0.0088, 50=0.007, 100=0.0051, 250=0.00388, 500=0.0031, 1000=0.00229 (EUR); Packaging: Cut Tape (CT); Resistance (Ohms): 100k; Tolerance: ±1%; Composition: Thick Film; Features: Moisture Resistant; Operating Temperature: -55°C ~ 155°C; Package / Case: 0603 (1608 Metric); Supplier Device Package: 0603; Size / Dimension: 0.063" L x 0.031" W (1.60mm x 0.80mm); ComponentLink1URL: http://www.yageo.com/documents/recent/PYu-RC_Group_51_RoHS_L_7.pdf; ComponentLink1Description: http://www.yageo.com/documents/recent/PYu-RC_Group_51_RoHS_L_7.pdf; Supplier 1: Digi-Key; Supplier Part Number 1: 311-100KHRCT-ND; Height - Seated (Max): 0.022" (0.55mm); Part Status: Active; Failure Rate: -
R49 = CRCW06031K00FKEA: as R37 on sheet Fan; Part Number: CRCW06031K00FKEA; Value: 1k; Manufacturer Part Number: CRCW06031K00FKEA; RoHS: RoHS Compliant; Category: Resistors; Stock 1: 862886; Pricing 1: 1=0.09, 10=0.027, 25=0.0196, 50=0.015, 100=0.011, 250=0.0084, 500=0.00674, 1000=0.00496, 2500=0.00431 (EUR); Packaging: Cut Tape (CT); Resistance (Ohms): 1k; Tolerance: ±1%; Composition: Thick Film; Features: Automotive AEC-Q200; Operating Temperature: -55°C ~ 155°C; Package / Case: 0603 (1608 Metric); Supplier Device Package: 0603; Size / Dimension: 0.061" L x 0.033" W (1.55mm x 0.85mm); Height: 0.020" (0.50mm); Number of Terminations: 2; ComponentLink1URL: http://www.vishay.com/docs/20035/dcrcwe3.pdf; ComponentLink1Description: http://www.vishay.com/docs/20035/dcrcwe3.pdf; Supplier 1: Digi-Key; Supplier Part Number 1: 541-1.00KHCT-ND
R50 = RC0603FR-071ML: RES SMD 1M OHM 1% 1/10W 0603; Manufacturer: Yageo; Power (Watts): 0.1W, 1/10W; Temperature Coefficient: ±100ppm/°C; Part Number: RC0603FR-071ML; Value: 1M; Manufacturer Part Number: RC0603FR-071ML; RoHS: RoHS Compliant; Category: Resistors; Stock 1: 3055845; Pricing 1: 1=0.09, 10=0.012, 25=0.0088, 50=0.0066, 100=0.0049, 250=0.00372, 500=0.00298, 1000=0.0022 (EUR); Packaging: Cut Tape (CT); Resistance (Ohms): 1M; Tolerance: ±1%; Composition: Thick Film; Features: Moisture Resistant; Operating Temperature: -55°C ~ 155°C; Package / Case: 0603 (1608 Metric); Supplier Device Package: 0603; Size / Dimension: 0.063" L x 0.031" W (1.60mm x 0.80mm); ComponentLink1URL: http://www.yageo.com/documents/recent/PYu-RC_Group_51_RoHS_L_7.pdf; ComponentLink1Description: http://www.yageo.com/documents/recent/PYu-RC_Group_51_RoHS_L_7.pdf; Supplier 1: Digi-Key; Supplier Part Number 1: 311-1.00MHRCT-ND; Height - Seated (Max): 0.022" (0.55mm); Part Status: Active; Failure Rate: -
R53 = RC0603FR-07280RL: RES SMD 280 OHM 1% 1/10W 0603; Manufacturer: Yageo; Resistance (Ohms): 280; Power (Watts): 0.1W, 1/10W; Temperature Coefficient: ±100ppm/°C; Part Number: RC0603FR-07280RL; Value: 280R; Manufacturer Part Number: RC0603FR-07280RL; RoHS: RoHS Compliant; Category: Resistors; Stock 1: 47; Pricing 1: 1=0.09, 10=0.012, 25=0.0088, 50=0.0066, 100=0.0049, 250=0.00372, 500=0.00298, 1000=0.0022 (EUR); Packaging: Cut Tape (CT); Tolerance: ±1%; Composition: Thick Film; Features: Moisture Resistant; Operating Temperature: -55°C ~ 155°C; Package / Case: 0603 (1608 Metric); Supplier Device Package: 0603; Size / Dimension: 0.063" L x 0.031" W (1.60mm x 0.80mm); ComponentLink1URL: http://www.yageo.com/documents/recent/PYu-RC_Group_51_RoHS_L_6.pdf; ComponentLink1Description: http://www.yageo.com/documents/recent/PYu-RC_Group_51_RoHS_L_6.pdf; Supplier 1: Digi-Key; Supplier Part Number 1: 311-280HRCT-ND; Height - Seated (Max): 0.022" (0.55mm); Part Status: Active; Failure Rate: -
TP33 TP34 = TP: Value: TP; Part Number: TP
U11 = LM358QT: as U17 on sheet Fan; Part Number: LM358QT; Value: LM358; Supplier 1: Digi-Key; Supplier Part Number 1: 497-12007-1-ND; Manufacturer Part Number: LM358QT; RoHS: RoHS Compliant; Category: Integrated Circuits (ICs); Stock 1: 1511; Pricing 1: 1=0.43, 10=0.324, 100=0.2013, 500=0.13776, 1000=0.10596 (EUR); Packaging: Cut Tape (CT); Output Type: -; -3db Bandwidth: -; Operating Temperature: 0°C ~ 70°C; Mounting Type: Surface Mount; Package / Case: 8-UFDFN Exposed Pad; Supplier Device Package: 8-DFN (2x2); ComponentLink1URL: http://www.st.com/content/ccc/resource/technical/document/datasheet/61/46/87/01/98/ed/44/c5/CD00000464.pdf/files/CD00000464.pdf/jcr:content/translations/en.CD00000464.pdf; ComponentLink1Description: http://www.st.com/content/ccc/resource/technical/document/datasheet/61/46/87/01/98/ed/44/c5/CD00000464.pdf/files/CD00000464.pdf/jcr:content/translations/en.CD00000464.pdf; Part Status: Active

## Sheet WiFi.SchDoc: WiFi Module
size A4; DrawnBy: A. Küllenberg; Revision: A; SheetNumber: 8; SheetTotal: 10
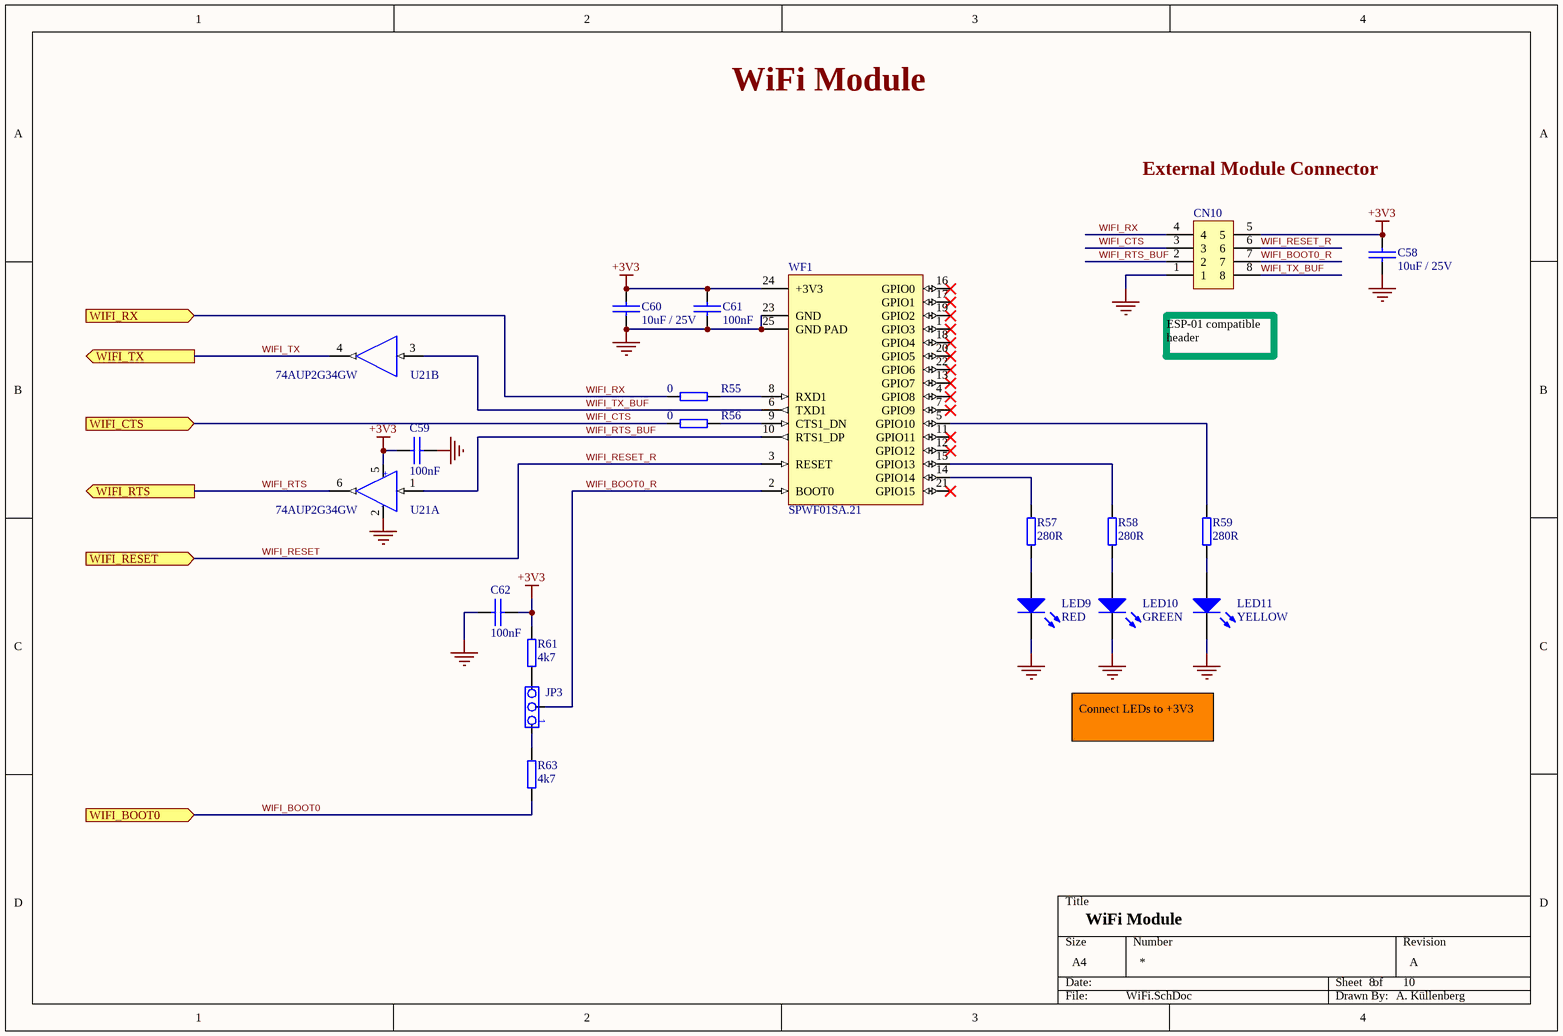
[diagram p6: WiFi.SchDoc]

### Parts
C58  10uF / 25V  [C0603]
C59  100nF  [C0603]
C60  10uF / 25V  [C0603]
C61  100nF  [C0603]
C62  100nF  [C0603]
CN10  HDR 2x4  [PPPC042LFBN-RC]  (value not drawn)
JP3  JP  [HDR1x3]  (value not drawn)
LED9  RED  [LED_0603_RED]
LED10  GREEN  [LED_0603_GREEN]
LED11  YELLOW  [LED_0603_YELLOW]
R55  0  [R0603]
R56  0  [R0603]
R57  280R  [R0603]
R58  280R  [R0603]
R59  280R  [R0603]
R61  4k7  [R0603]
R63  4k7  [R0603]
U21  74AUP2G34GW  [SOT363]  (parts A,B of 2)
WF1  SPWF01SA.21  [SPWF01SA]

### Ports
WIFI_BOOT0 (in), WIFI_CTS (in), WIFI_RESET (in), WIFI_RTS (out), WIFI_RX (in), WIFI_TX (out)

### Nets
+3V3: C58.2 C59.2 C60.2 C61.2 C62.1 CN10.5 R61.2 U21.5 WF1.24(+3V3)
GND: C58.1 C59.1 C60.1 C61.1 C62.2 CN10.1 LED9.2(K) LED10.2(K) LED11.2(K) U21.2 WF1.23(GND) WF1.25(GND_PAD)
WIFI_BOOT0: R63.1 ; port WIFI_BOOT0  [project net PC12]
WIFI_BOOT0_R: CN10.7 JP3.2 WF1.2(BOOT0)
WIFI_CTS: CN10.3 R56.1 ; port WIFI_CTS  [project net USART3_RTS]
WIFI_RESET: CN10.6 WF1.3(RESET) ; port WIFI_RESET  [also labelled WIFI_RESET_R]  [project net PB5]
WIFI_RTS: U21.6 ; port WIFI_RTS  [project net USART3_CTS]
WIFI_RTS_BUF: CN10.2 U21.1 WF1.10(RTS1_DP)
WIFI_RX: CN10.4 R55.1 ; port WIFI_RX  [project net USART3_TX]
WIFI_TX: U21.4 ; port WIFI_TX  [project net USART3_RX]
WIFI_TX_BUF: CN10.8 U21.3 WF1.6(TXD1)
NetJP3_1: JP3.1 R63.2
NetJP3_3: JP3.3 R61.1
NetLED9_1: LED9.1(A) R57.1
NetLED10_1: LED10.1(A) R58.1
NetLED11_1: LED11.1(A) R59.1
NetR55_2: R55.2 WF1.8(RXD1)
NetR56_2: R56.2 WF1.9(CTS1_DN)
NetR57_2: R57.2 WF1.14(GPIO14)
NetR58_2: R58.2 WF1.15(GPIO13)
NetR59_2: R59.2 WF1.5(GPIO10)

Not connected (* = marked no-connect by the designer): WF1 1(GPIO3)* 4(GPIO8)* 7(GPIO9)* 11(GPIO11)* 12(GPIO12)* 13(GPIO7)* 16(GPIO0)* 17(GPIO1)* 18(GPIO4)* 19(GPIO2)* 20(GPIO5)* 21(GPIO15)* 22(GPIO6)*

### Notes on the sheet
- WiFi Module
- External Module Connector
- (near CN10) ESP-01 compatible header
- Connect LEDs to +3V3
- (in symbol 74AUP2G34GW,125, part A) +; -

### Library data of the parts
C58 C60 = ZRB18AR61E106ME01L: as C41 on sheet Fan; Part Number: ZRB18AR61E106ME01L; Value: 10uF / 25V; Supplier 1: Digi-Key; Supplier Part Number 1: 490-10991-1-ND; Manufacturer Part Number: ZRB18AR61E106ME01L; RoHS: RoHS Compliant; Category: Capacitors; Stock 1: 23575; Pricing 1: 1=0.4, 10=0.278, 25=0.2284, 50=0.195, 100=0.1671, 250=0.13924, 500=0.12532, 1000=0.10583 (EUR); Packaging: Cut Tape (CT); Voltage - Rated: 25V; Temperature Coefficient: X5R; Mounting Type: Surface Mount, MLCC; Operating Temperature: -55°C ~ 85°C; Applications: Acoustic Noise Reduction; Ratings: -; Package / Case: 0603 (1608 Metric); Size / Dimension: 0.063" L x 0.031" W (1.60mm x 0.80mm); Height - Seated (Max): -; Thickness (Max): 0.047" (1.20mm); Lead Spacing: -; Features: Interposer Termination; Lead Style: -; ComponentLink1URL: http://search.murata.co.jp/Ceramy/image/img/A01X/G101/ENG/ZRB18AR61E106ME01-01.pdf; ComponentLink1Description: http://search.murata.co.jp/Ceramy/image/img/A01X/G101/ENG/ZRB18AR61E106ME01-01.pdf; Part Status: Active
C59 C61 C62 = C0603C104K5RACTU: as C40 on sheet Fan; Part Number: C0603C104K5RACTU; Value: 100nF; Supplier 1: Digi-Key; Supplier Part Number 1: 399-5089-1-ND; Manufacturer Part Number: C0603C104K5RACTU; RoHS: RoHS Compliant; Category: Capacitors; Stock 1: 1628757; Pricing 1: 1=0.09, 10=0.037, 50=0.0198, 100=0.0167, 250=0.01372, 500=0.01174, 1000=0.00914 (EUR); Packaging: Cut Tape (CT); Voltage - Rated: 50V; Temperature Coefficient: X7R; Mounting Type: Surface Mount, MLCC; Operating Temperature: -55°C ~ 125°C; Applications: General Purpose; Ratings: -; Package / Case: 0603 (1608 Metric); Size / Dimension: 0.063" L x 0.031" W (1.60mm x 0.80mm); Height - Seated (Max): -; Thickness (Max): 0.034" (0.87mm); Lead Spacing: -; Features: -; Lead Style: -; ComponentLink1URL: http://www.kemet.com/docfinder?Partnumber=C0603C104K5RACTU; ComponentLink1Description: http://www.kemet.com/docfinder?Partnumber=C0603C104K5RACTU
CN10 = PPPC042LFBN-RC: CONN HEADER FMAL 8PS .1" DL GOLD; Manufacturer: Sullins Connector Solutions; Number of Positions: 8; Number of Positions Loaded: All; Current Rating: 3A; Voltage Rating: 250V; Pitch - Mating: 0.100" (2.54mm); Style: Board to Board; Contact Length - Post: 0.126" (3.20mm); Material Flammability Rating: UL94 V-0; Part Number: PPPC042LFBN-RC; Value: HDR 2x4; Supplier 1: Digi-Key; Supplier Part Number 1: S7107-ND; Manufacturer Part Number: PPPC042LFBN-RC; RoHS: RoHS Compliant; Category: Connectors, Interconnects; Stock 1: 5335; Pricing 1: 1=0.8, 10=0.667, 25=0.6172, 50=0.5556, 100=0.4938, 250=0.43208, 500=0.39502, 1000=0.35799, 2500=0.32096 (EUR); Packaging: Bulk; Connector Type: Header; Contact Type: Female Socket; Number of Rows: 2; Mounting Type: Through Hole; Termination: Solder; Fastening Type: Push-Pull; Features: -; ComponentLink1URL: http://www.sullinscorp.com/drawings/78_P(N)PxCxxxLFBN-RC,_10492-H.pdf; ComponentLink1Description: http://www.sullinscorp.com/drawings/78_P(N)PxCxxxLFBN-RC,_10492-H.pdf; Contact Material: Phosphor Bronze; Operating Temperature: -40°C ~ 105°C; Part Status: Active; Row Spacing - Mating: 0.100" (2.54mm); Contact Finish - Mating: Gold; Contact Finish Thickness - Mating: Flash; Insulation Color: Black; Insulation Height: 0.335" (8.51mm); Contact Shape: Square; Ingress Protection: -; Contact Finish - Post: Gold; Insulation Material: Polyester; Mated Stacking Heights: -; Contact Finish Thickness - Post: Flash; Applications: -
JP3 = 61300311121: as JP1 on sheet PowerPath; Part Number: 61300311121; Value: JP; Supplier 1: Digi-Key; Supplier Part Number 1: 732-5316-ND; Manufacturer Part Number: 61300311121; RoHS: RoHS Compliant; Category: Connectors, Interconnects; Stock 1: 31558; Pricing 1: 1=0.21, 10=0.191, 25=0.1628, 50=0.1424, 100=0.1323, 1000=0.09157 (EUR); Packaging: Bulk; Part Status: Active; Connector Type: Header; Contact Type: Male Pin; Number of Rows: 1; Row Spacing - Mating: -; Mounting Type: Through Hole; Termination: Solder; Fastening Type: -; Insulation Height: 0.100" (2.54mm); Contact Shape: Square; Contact Finish - Mating: Gold; Contact Finish Thickness - Mating: -; Contact Finish - Post: -; Contact Material: Copper Alloy; Insulation Material: Polybutylene Terephthalate (PBT); Features: -; Operating Temperature: -40°C ~ 125°C; Ingress Protection: -; Insulation Color: Black; Mated Stacking Heights: -; Contact Finish Thickness - Post: -; Applications: -; ComponentLink1URL: http://katalog.we-online.de/em/datasheet/6130xx11121.pdf; ComponentLink1Description: http://katalog.we-online.de/em/datasheet/6130xx11121.pdf
LED9 = LTST-C190KRKT: LED RED CLEAR 0603 SMD; Manufacturer: Lite-On Inc.; Voltage - Forward (Vf) (Typ): 2V; Viewing Angle: 130°; Wavelength - Dominant: 631nm; Wavelength - Peak: 639nm; Millicandela Rating: 99mcd; Current - Test: 20mA; Lens Color: Colorless; Lens Style/Size: Rectangle with Flat Top, 1.10mm x 0.80mm; Part Number: LTST-C190KRKT; Value: RED; Supplier 1: Digi-Key; Supplier Part Number 1: 160-1436-1-ND; Manufacturer Part Number: LTST-C190KRKT; RoHS: RoHS Compliant; Category: Optoelectronics; Stock 1: 1183099; Pricing 1: 1=0.24, 10=0.176, 25=0.1296, 100=0.0926, 250=0.063, 500=0.05556, 1000=0.04353 (EUR); Packaging: Cut Tape (CT); Mounting Type: Surface Mount; Package / Case: 0603 (1608 Metric); ComponentLink1URL: http://optoelectronics.liteon.com/upload/download/DS-22-99-0151/S_110_LTST-C190KRKT.pdf; ComponentLink1Description: http://optoelectronics.liteon.com/upload/download/DS-22-99-0151/S_110_LTST-C190KRKT.pdf; Supplier Device Package: *; Color: Red; Lens Transparency: Clear; Size / Dimension: 1.60mm L x 0.80mm W; Height (Max): 0.80mm; Features: -
LED10 = LTST-C190KGKT: LED GREEN CLEAR 0603 SMD; Manufacturer: Lite-On Inc.; Voltage - Forward (Vf) (Typ): 2V; Viewing Angle: 130°; Wavelength - Dominant: 571nm; Wavelength - Peak: 574nm; Millicandela Rating: 35mcd; Current - Test: 20mA; Lens Color: Colorless; Lens Style/Size: Rectangle with Flat Top, 1.10mm x 0.80mm; Part Number: LTST-C190KGKT; Value: GREEN; Supplier 1: Digi-Key; Supplier Part Number 1: 160-1435-1-ND; Manufacturer Part Number: LTST-C190KGKT; RoHS: RoHS Compliant; Category: Optoelectronics; Stock 1: 1245030; Pricing 1: 1=0.24, 10=0.176, 25=0.1296, 100=0.0926, 250=0.063, 500=0.05556, 1000=0.04353 (EUR); Packaging: Cut Tape (CT); Mounting Type: Surface Mount; Package / Case: 0603 (1608 Metric); ComponentLink1URL: http://optoelectronics.liteon.com/upload/download/DS22-2000-074/S_110_LTST-C190KGKT.pdf; ComponentLink1Description: http://optoelectronics.liteon.com/upload/download/DS22-2000-074/S_110_LTST-C190KGKT.pdf; Supplier Device Package: *; Color: Green; Lens Transparency: Clear; Size / Dimension: 1.60mm L x 0.80mm W; Height (Max): 0.80mm; Features: -
LED11 = LTST-C190KSKT: as LED8 on sheet PowerPath; Part Number: LTST-C190KSKT; Value: YELLOW; Supplier 1: Digi-Key; Supplier Part Number 1: 160-1437-1-ND; Manufacturer Part Number: LTST-C190KSKT; RoHS: RoHS Compliant; Category: Optoelectronics; Stock 1: 229638; Pricing 1: 1=0.27, 10=0.199, 25=0.1468, 100=0.1049, 250=0.07132, 500=0.06292, 1000=0.0493 (EUR); Packaging: Cut Tape (CT); Mounting Type: Surface Mount; Package / Case: 0603 (1608 Metric); ComponentLink1URL: http://optoelectronics.liteon.com/upload/download/DS-22-99-0189/S_110_LTST-C190KSKT.pdf; ComponentLink1Description: http://optoelectronics.liteon.com/upload/download/DS-22-99-0189/S_110_LTST-C190KSKT.pdf; Color: Yellow; Lens Transparency: Clear; Size / Dimension: 1.60mm L x 0.80mm W; Height (Max): 0.80mm; Features: -; Part Status: Active
R55 R56 = RC0603JR-070RL: RES SMD 0.0OHM JUMPER 1/10W 0603; Manufacturer: Yageo; Resistance (Ohms): 0.0; Power (Watts): 0.1W, 1/10W; Part Number: RC0603JR-070RL; Value: 0; Manufacturer Part Number: RC0603JR-070RL; RoHS: RoHS Compliant; Category: Resistors; Stock 1: 12194512; Pricing 1: 1=0.09, 10=0.009, 25=0.0072, 50=0.0052, 100=0.0039, 250=0.003, 500=0.0024, 1000=0.00176 (EUR); Packaging: Cut Tape (CT); Tolerance: Jumper; Composition: Thick Film; Features: Moisture Resistant; Temperature Coefficient: -; Operating Temperature: -55°C ~ 155°C; Package / Case: 0603 (1608 Metric); Supplier Device Package: 0603; Size / Dimension: 0.063" L x 0.031" W (1.60mm x 0.80mm); ComponentLink1URL: http://www.yageo.com/documents/recent/PYu-RC_Group_51_RoHS_L_7.pdf; ComponentLink1Description: http://www.yageo.com/documents/recent/PYu-RC_Group_51_RoHS_L_7.pdf; Supplier 1: Digi-Key; Supplier Part Number 1: 311-0.0GRCT-ND; Height - Seated (Max): 0.022" (0.55mm); Part Status: Active; Failure Rate: -
R57-R59 = RC0603FR-07280RL: as R53 on sheet PowerPath; Part Number: RC0603FR-07280RL; Value: 280R; Manufacturer Part Number: RC0603FR-07280RL; RoHS: RoHS Compliant; Category: Resistors; Stock 1: 47; Pricing 1: 1=0.09, 10=0.012, 25=0.0088, 50=0.0066, 100=0.0049, 250=0.00372, 500=0.00298, 1000=0.0022 (EUR); Packaging: Cut Tape (CT); Tolerance: ±1%; Composition: Thick Film; Features: Moisture Resistant; Operating Temperature: -55°C ~ 155°C; Package / Case: 0603 (1608 Metric); Supplier Device Package: 0603; Size / Dimension: 0.063" L x 0.031" W (1.60mm x 0.80mm); ComponentLink1URL: http://www.yageo.com/documents/recent/PYu-RC_Group_51_RoHS_L_6.pdf; ComponentLink1Description: http://www.yageo.com/documents/recent/PYu-RC_Group_51_RoHS_L_6.pdf; Supplier 1: Digi-Key; Supplier Part Number 1: 311-280HRCT-ND; Height - Seated (Max): 0.022" (0.55mm); Part Status: Active; Failure Rate: -
R61 R63 = CRCW06034K70FKEA: as R34 on sheet Fan; Part Number: CRCW06034K70FKEA; Value: 4k7; Manufacturer Part Number: CRCW06034K70FKEA; RoHS: RoHS Compliant; Category: Resistors; Stock 1: 324271; Pricing 1: 1=0.09, 10=0.027, 25=0.0196, 50=0.015, 100=0.011, 250=0.0084, 500=0.00674, 1000=0.00496, 2500=0.00431 (EUR); Packaging: Cut Tape (CT); Resistance (Ohms): 4.7k; Tolerance: ±1%; Composition: Thick Film; Features: Automotive AEC-Q200; Operating Temperature: -55°C ~ 155°C; Package / Case: 0603 (1608 Metric); Supplier Device Package: 0603; Size / Dimension: 0.061" L x 0.033" W (1.55mm x 0.85mm); Height: 0.020" (0.50mm); Number of Terminations: 2; ComponentLink1URL: http://www.vishay.com/docs/20035/dcrcwe3.pdf; ComponentLink1Description: http://www.vishay.com/docs/20035/dcrcwe3.pdf; Supplier 1: Digi-Key; Supplier Part Number 1: 541-4.70KHCT-ND
U21 = 74AUP2G34GW,125: IC BUFF DL LOW PWR N-INV 6TSSOP; Manufacturer: Nexperia USA Inc.; Logic Type: Buffer, Non-Inverting; Number of Bits per Element: 1; Part Number: 74AUP2G34GW,125; Value: 74AUP2G34GW; Supplier 1: Digi-Key; Supplier Part Number 1: 1727-3208-1-ND; Manufacturer Part Number: 74AUP2G34GW,125; RoHS: RoHS Compliant; Category: Integrated Circuits (ICs); Stock 1: 4222; Pricing 1: 1=0.44, 10=0.376, 100=0.2804, 500=0.2203, 1000=0.17023 (EUR); Packaging: Cut Tape (CT); Part Status: Active
WF1 = SPWF01SA.21: RF TXRX MODULE WIFI CHIP ANT; Manufacturer: STMicroelectronics; Protocol: 802.11b/g/n; Modulation: DSSS, OFDM; Frequency: 2.4GHz; Data Rate: 65Mbps; Power - Output: 18.3dBm; Sensitivity: -96dBm; Serial Interfaces: UART; Antenna Type: Integrated, Chip; Memory Size: 512kB Flash, 64kB RAM; Voltage - Supply: 3.3V; Current - Receiving: 105mA; Current - Transmitting: 210mA ~ 344mA; Part Number: SPWF01SA.21; Value: SPWF01SA.21; Packaging: Tray; Supplier 1: Digi-Key; Supplier Part Number 1: 497-14638-ND; Manufacturer Part Number: SPWF01SA.21; Pricing 1: 1=15.26, 10=13.811, 100=11.6301, 500=10.17632 (EUR); RoHS: RoHS Compliant; Category: RF/IF and RFID; Stock 1: 182; Part Status: Active; RF Family/Standard: WiFi; Mounting Type: Surface Mount; Operating Temperature: -40°C ~ 85°C; Package / Case: Module; ComponentLink1URL: http://www.st.com/content/ccc/resource/technical/document/datasheet/ba/8c/b2/64/02/bc/4e/05/DM00102124.pdf/files/DM00102124.pdf/jcr:content/translations/en.DM00102124.pdf; ComponentLink1Description: http://www.st.com/content/ccc/resource/technical/document/datasheet/ba/8c/b2/64/02/bc/4e/05/DM00102124.pdf/files/DM00102124.pdf/jcr:content/translations/en.DM00102124.pdf